# EAGLE design JtagAdapter 1.0 (EAGLE 5.11)
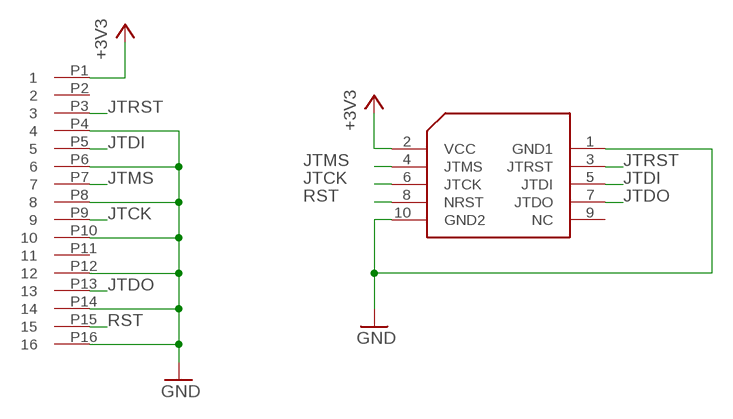
[diagram p0: schematic, sheet 1]

## Parts
U$1  STM32-JTAG-10PSTM32-JTAG-ADAPTER(INVERTED)  STM32-JTAG-10PADAPTER(INVERTED)  [STM32-JTAG-10P]
U$2  IDC-DIP-2P16-EIDC-DIP-2P16-E  [IDC-DIP-2P16-E]

## Nets
+3V3: U$1.2(VCC) U$2.P1
GND: U$1.1(GND1) U$1.10(GND2) U$2.P4 U$2.P6 U$2.P8 U$2.P10 U$2.P12 U$2.P14 U$2.P16
JTCK: U$1.6(JTCK) U$2.P9
JTDI: U$1.5(JTDI) U$2.P5
JTDO: U$1.7(JTDO) U$2.P13
JTMS: U$1.4(JTMS) U$2.P7
JTRST: U$1.3(JTRST) U$2.P3
RST: U$1.8(NRST) U$2.P15
Unconnected: U$1.9(NC) U$2.P2 U$2.P11

## Library data of the parts
U$1 = Pygmy:STM32-JTAG-10P
U$2 = Pygmy:IDC-DIP-2P16-E

## Board
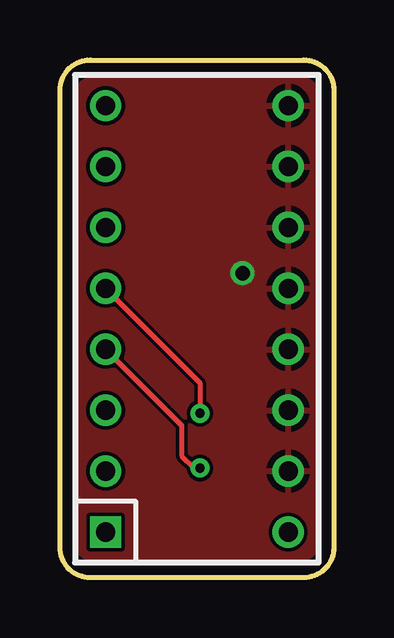
[diagram p1: board, top side]
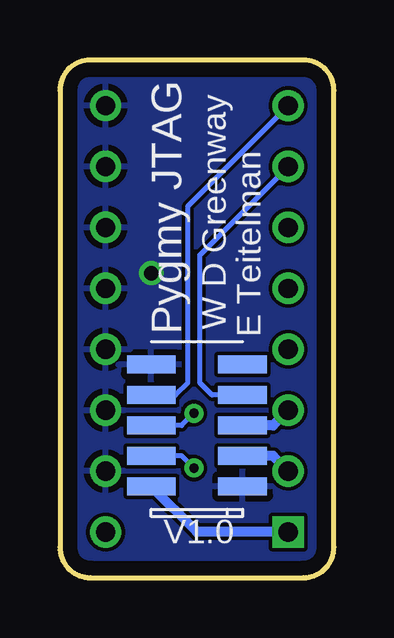
[diagram p2: board, bottom side, seen from below]

Size 11.43 x 21.59 mm. Coordinates in mm from the lower left corner, seen from the top.
Outline: 1.27,0 arc-90 0,1.27 0,20.32 arc-90 1.27,21.59 10.16,21.59 arc-90 11.43,20.32 11.43,1.27 arc-90 10.16,0 1.27,0
Copper layers (1*16): Top 0.035mm / dielectric 1.5mm / Bottom 0.035mm
Design rules "AdvancedCircuits *": minimum track width 6mil, minimum drill 15mil, track to track 6mil, track to pad 6mil, pad to pad 4mil, via to via 6mil, smd to smd 4mil, copper to edge 24mil, drill to drill 8mil, minimum pad ring 10mil, minimum via ring 8mil, stop-mask expansion 4mil, vias tented up to drill 0mil, thermal gap 10mil

### Footprints (pad centres in the part's own frame; a part is rotated, then mirrored left to right if it is on the bottom)
STM32-JTAG-10P = smd 0.762 x 2.032: 1 0,0; 2 0,3.81; 3 1.27,0; 4 1.27,3.81; 5 2.54,0; 6 2.54,3.81; 7 3.81,0; 8 3.81,3.81; 9 5.08,0; 10 5.08,3.81
IDC-DIP-2P16-E = drill 0.8 square: P1 7.62,0 | drill 0.8 round: P2 0,0; P3 7.62,-2.54; P4 0,-2.54; P5 7.62,-5.08; P6 0,-5.08; P7 7.62,-7.62; P8 0,-7.62; P9 7.62,-10.16; P10 0,-10.16; P11 7.62,-12.7; P12 0,-12.7; P13 7.62,-15.24; P14 0,-15.24; P15 7.62,-17.78; P16 0,-17.78

### Placement (x,y rotation side)
U$1  3.81,3.81 90 bottom
U$2  9.53,1.91 180 top

### Tracks (layer width: path | path; a pad name or v marks a point on that pad's centre or on a via)
+3V3
  Bottom 0.406: U$2.P1 5.71,1.91 U$1.2
GND  (via drill 0.6)
  other vias: 7.62,12.7
  pour Bottom: -1.27,22.86 12.7,22.86 12.7,-1.27 -1.27,-1.27
  pour Top: -1.27,22.86 12.7,22.86 12.7,-1.27 -1.27,-1.27
JTCK  (via drill 0.38)
  Top 0.203: v5.84,6.86 5.84,8.13 U$2.P9
  Bottom 0.203: U$1.6 6.35,6.35 v5.84,6.86
JTDI
  Bottom 0.406: U$1.5 2.54,6.35 U$2.P5
JTDO
  Bottom 0.203: U$1.7 5.08,7.62 5.59,8.13 5.59,13.46 U$2.P13
JTMS  (via drill 0.38)
  Top 0.203: v5.84,4.57 5.59,4.57 5.08,5.08 5.08,6.35 U$2.P7
  Bottom 0.203: U$1.4 6.35,5.08 v5.84,4.57
JTRST
  Bottom 0.406: U$1.3 2.54,5.08 U$2.P3
RST
  Bottom 0.203: U$1.8 6.6,7.62 6.1,8.13 6.1,15.49 U$2.P15

### Text on the board
_bsilk: W D Greenway | E Teitelman | Pygmy JTAG | V1.0